# Altium schematic sheet TOP.SchDoc
size A2
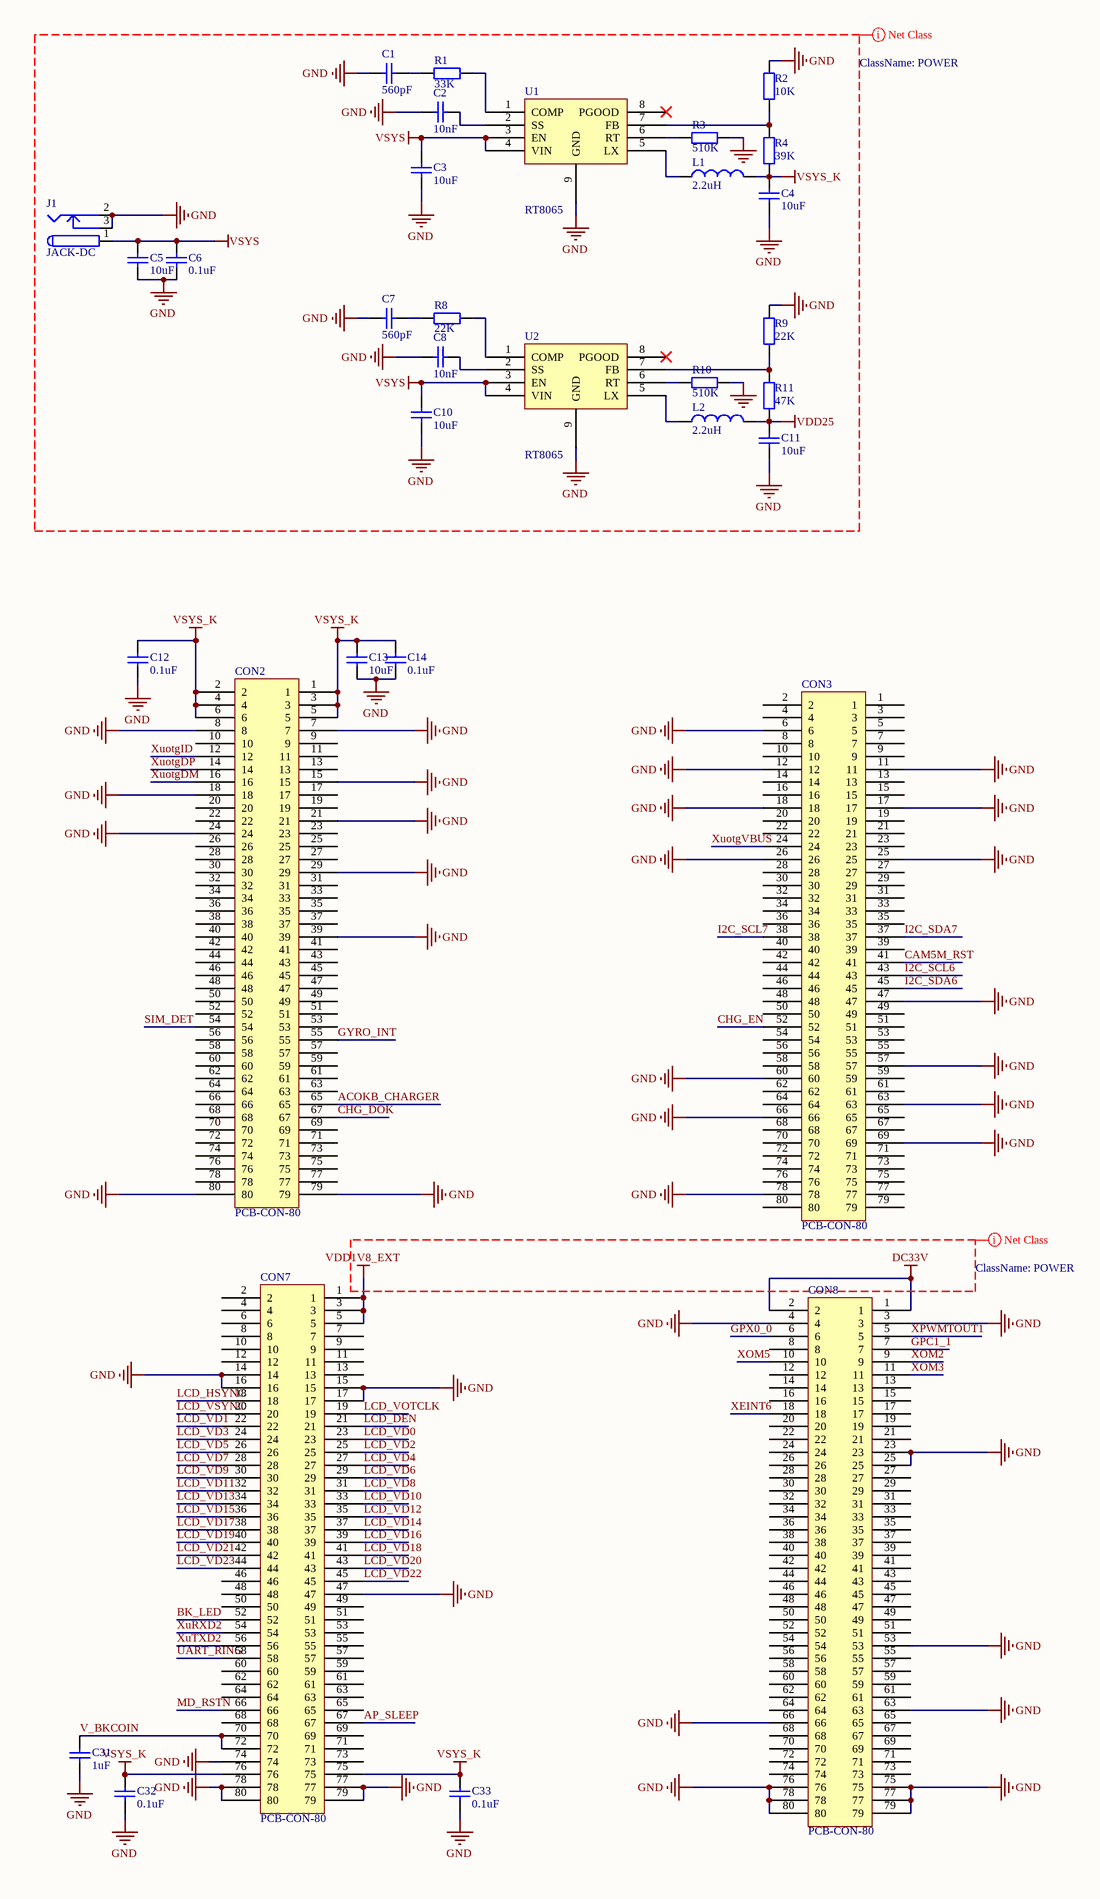
[diagram p0: TOP.SchDoc, left]
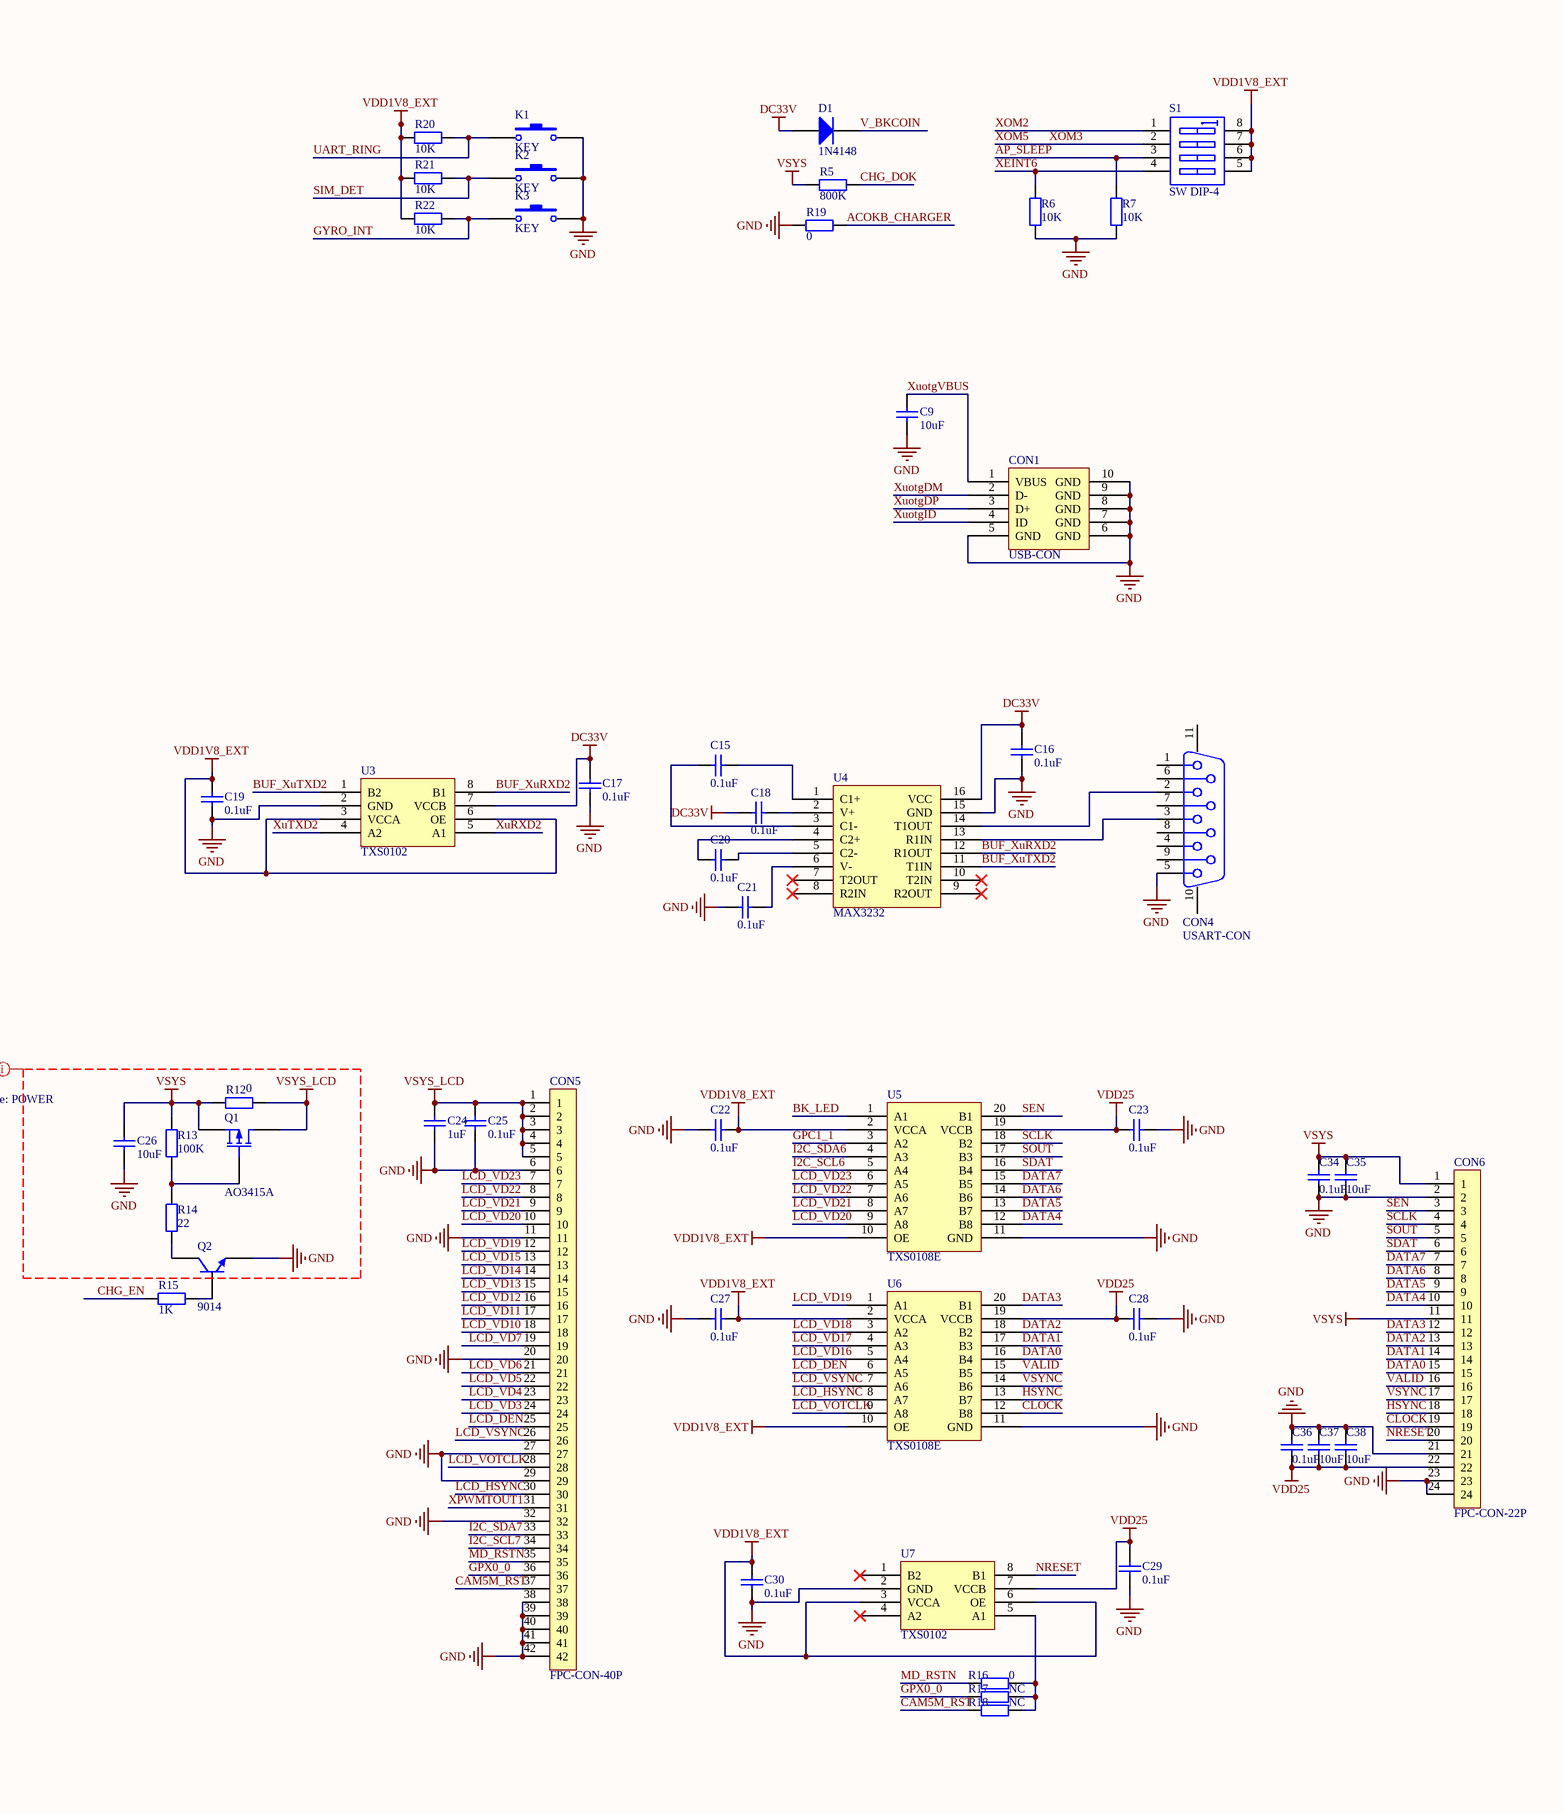
[diagram p1: TOP.SchDoc, right]

## Parts
C1  value 560pF  [0603]  (hidden comment: Cap)
C2  value 10nF  [0603]  (hidden comment: Cap)
C3  value 10uF  [0805]  (hidden comment: Cap)
C4  value 10uF  [0805]  (hidden comment: Cap)
C5  value 10uF  [0805]  (hidden comment: Cap)
C6  value 0.1uF  [0603]  (hidden comment: Cap)
C7  value 560pF  [0603]  (hidden comment: Cap)
C8  value 10nF  [0603]  (hidden comment: Cap)
C9  value 10uF  [0805]  (hidden comment: Cap)
C10  value 10uF  [0805]  (hidden comment: Cap)
C11  value 10uF  [0805]  (hidden comment: Cap)
C12  value 0.1uF  [0603]  (hidden comment: Cap)
C13  value 10uF  [0805]  (hidden comment: Cap)
C14  value 0.1uF  [0603]  (hidden comment: Cap)
C15  value 0.1uF  [0603]  (hidden comment: Cap)
C16  value 0.1uF  [0603]  (hidden comment: Cap)
C17  value 0.1uF  [0603]  (hidden comment: Cap)
C18  value 0.1uF  [0603]  (hidden comment: Cap)
C19  value 0.1uF  [0603]  (hidden comment: Cap)
C20  value 0.1uF  [0603]  (hidden comment: Cap)
C21  value 0.1uF  [0603]  (hidden comment: Cap)
C22  value 0.1uF  [0603]  (hidden comment: Cap)
C23  value 0.1uF  [0603]  (hidden comment: Cap)
C24  value 1uF  [0805]  (hidden comment: Cap)
C25  value 0.1uF  [0603]  (hidden comment: Cap)
C26  value 10uF  [0805]  (hidden comment: Cap)
C27  value 0.1uF  [0603]  (hidden comment: Cap)
C28  value 0.1uF  [0603]  (hidden comment: Cap)
C29  value 0.1uF  [0603]  (hidden comment: Cap)
C30  value 0.1uF  [0603]  (hidden comment: Cap)
C31  value 1uF  [0805]  (hidden comment: Cap)
C32  value 0.1uF  [0603]  (hidden comment: Cap)
C33  value 0.1uF  [0603]  (hidden comment: Cap)
C34  value 0.1uF  [0603]  (hidden comment: Cap)
C35  value 10uF  [0805]  (hidden comment: Cap)
C36  value 0.1uF  [0603]  (hidden comment: Cap)
C37  value 10uF  [0805]  (hidden comment: Cap)
C38  value 10uF  [0805]  (hidden comment: Cap)
CON1  USB-CON  [USB-CON]
CON2  PCB-CON-80  [PCB-CON-80]
CON3  PCB-CON-80  [PCB-CON-80]
CON4  USART-CON  [USART-CON]
CON5  FPC-CON-40P  [FPC-CON-40P]
CON6  FPC-CON-22P  [FPC-CON-22P]
CON7  PCB-CON-80  [PCB-CON-80]
CON8  PCB-CON-80  [PCB-CON-80]
D1  1N4148  [1206]
J1  JACK-DC  [JACK-DC]
K1  KEY  [KEY(3*6*2.5)]
K2  KEY  [KEY(3*6*2.5)]
K3  KEY  [KEY(3*6*2.5)]
L1  value 2.2uH  [1008]  (hidden comment: Inductor)
L2  value 2.2uH  [1008]  (hidden comment: Inductor)
Q1  AO3415A  [SOT-23]
Q2  9014  [SOT-23]
R1  value 33K  [0603]  (hidden comment: Res2)
R2  value 10K  [0603]  (hidden comment: Res2)
R3  value 510K  [0603]  (hidden comment: Res2)
R4  value 39K  [0603]  (hidden comment: Res2)
R5  value 800K  [0603]  (hidden comment: Res2)
R6  value 10K  [0603]  (hidden comment: Res2)
R7  value 10K  [0603]  (hidden comment: Res2)
R8  value 22K  [0603]  (hidden comment: Res2)
R9  value 22K  [0603]  (hidden comment: Res2)
R10  value 510K  [0603]  (hidden comment: Res2)
R11  value 47K  [0603]  (hidden comment: Res2)
R12  value 0  [0603]  (hidden comment: Res2)
R13  value 100K  [0603]  (hidden comment: Res2)
R14  value 22  [0603]  (hidden comment: Res2)
R15  value 1K  [0603]  (hidden comment: Res2)
R16  value 0  [0603]  (hidden comment: Res2)
R17  value NC  [0603]  (hidden comment: Res2)
R18  value NC  [0603]  (hidden comment: Res2)
R19  value 0  [0603]  (hidden comment: Res2)
R20  value 10K  [0603]  (hidden comment: Res2)
R21  value 10K  [0603]  (hidden comment: Res2)
R22  value 10K  [0603]  (hidden comment: Res2)
S1  SW DIP-4  [SW-4]
U1  RT8065  [RT8065(SOP8)]
U2  RT8065  [RT8065(SOP8)]
U3  TXS0102  [TXS0102(SOP8)]
U4  MAX3232  [MAX3232(SOP16)]
U5  TXS0108E  [TXS0108E(SOP20)]
U6  TXS0108E  [TXS0108E(SOP20)]
U7  TXS0102  [TXS0102(SOP8)]

## Nets
DC33V: C16.1 C17.2 C18.1 CON8.1 CON8.2 D1.1(A) U3.7(VCCB) U4.16(VCC)
GND: C1.2 C2.2 C3.1 C4.1 C5.1 C6.2 C7.2 C8.2 C9.1 C10.1 C11.1 C12.2 C13.1 C14.2 C16.2 C17.1 C19.1 C21.1 C22.1 C23.2 C24.2 C25.1 C26.1 C27.1 C28.2 C29.1 C30.1 C31.2 C32.2 C33.2 C34.1 C35.1 C36.2 C37.2 C38.2 CON1.5(GND) CON1.6(GND) CON1.7(GND) CON1.8(GND) CON1.9(GND) CON1.10(GND) CON2.7 CON2.8 CON2.15 CON2.18 CON2.21 CON2.24 CON2.29 CON2.39 CON2.79 CON2.80 CON3.6 CON3.11 CON3.12 CON3.17 CON3.18 CON3.25 CON3.26 CON3.47 CON3.57 CON3.60 CON3.63 CON3.66 CON3.69 CON3.78 CON4.5 CON5.6 CON5.11 CON5.20 CON5.27 CON5.29 CON5.32 CON5.38 CON5.39 CON5.40 CON5.41 CON5.42 CON6.2 CON6.21 CON6.23 CON6.24 CON7.14 CON7.15 CON7.16 CON7.17 CON7.47 CON7.74 CON7.77 CON7.78 CON7.79 CON7.80 CON8.3 CON8.4 CON8.23 CON8.25 CON8.53 CON8.63 CON8.66 CON8.75 CON8.76 CON8.77 CON8.78 CON8.79 CON8.80 J1.2 J1.3 K1.2 K2.2 K3.2 Q2.2(E) R2.2 R3.2 R6.2 R7.1 R9.2 R10.2 R19.1 U1.9(GND) U2.9(GND) U3.2(GND) U4.15(GND) U5.11(GND) U6.11(GND) U7.2(GND)
VDD1V8_EXT: C19.2 C22.2 C27.2 C30.2 CON7.1 CON7.3 CON7.5 R20.1 R21.1 R22.1 S1.5(B4) S1.6(B3) S1.7(B2) S1.8(B1) U3.3(VCCA) U3.6(OE) U5.2(VCCA) U5.10(OE) U6.2(VCCA) U6.10(OE) U7.3(VCCA) U7.6(OE)
VDD25: C11.2 C23.1 C28.1 C29.2 C36.1 C37.1 C38.1 CON6.22 L2.2 R11.1 U5.19(VCCB) U6.19(VCCB) U7.7(VCCB)
VSYS: C3.2 C5.2 C6.1 C10.2 C26.2 C34.2 C35.2 CON6.1 CON6.11 J1.1 Q1.2(S) R5.1 R12.1 R13.2 U1.3(EN) U1.4(VIN) U2.3(EN) U2.4(VIN)
VSYS_K: C4.2 C12.1 C13.2 C14.1 C32.1 C33.1 CON2.1 CON2.2 CON2.3 CON2.4 CON2.5 CON2.6 CON7.75 CON7.76 L1.2 R4.1
VSYS_LCD: C24.1 C25.2 CON5.1 CON5.2 CON5.3 CON5.4 CON5.5 Q1.3(D) R12.2
ACOKB_CHARGER: CON2.65 R19.2
AP_SLEEP: CON7.67 R7.2 S1.3(A3)
BK_LED: CON7.52 U5.1(A1)
BUF_XuRXD2: U3.8(B1) U4.12(R1OUT)
BUF_XuTXD2: U3.1(B2) U4.11(T1IN)
CAM5M_RST: CON3.41 CON5.37 R18.1
CHG_DOK: CON2.67 R5.2
CHG_EN: CON3.52 R15.1
CLOCK: CON6.19 U6.12(B8)
DATA0: CON6.15 U6.16(B4)
DATA1: CON6.14 U6.17(B3)
DATA2: CON6.13 U6.18(B2)
DATA3: CON6.12 U6.20(B1)
DATA4: CON6.10 U5.12(B8)
DATA5: CON6.9 U5.13(B7)
DATA6: CON6.8 U5.14(B6)
DATA7: CON6.7 U5.15(B5)
GPC1_1: CON8.7 U5.3(A2)
GPX0_0: CON5.36 CON8.6 R17.1
GYRO_INT: CON2.55 K3.1 R22.2
HSYNC: CON6.18 U6.13(B7)
I2C_SCL6: CON3.43 U5.5(A4)
I2C_SCL7: CON3.38 CON5.34
I2C_SDA6: CON3.45 U5.4(A3)
I2C_SDA7: CON3.37 CON5.33
LCD_DEN: CON5.25 CON7.21 U6.6(A5)
LCD_HSYNC: CON5.30 CON7.18 U6.8(A7)
LCD_VD0: CON7.23
LCD_VD1: CON7.22
LCD_VD2: CON7.25
LCD_VD3: CON5.24 CON7.24
LCD_VD4: CON5.23 CON7.27
LCD_VD5: CON5.22 CON7.26
LCD_VD6: CON5.21 CON7.29
LCD_VD7: CON5.19 CON7.28
LCD_VD8: CON7.31
LCD_VD9: CON7.30
LCD_VD10: CON5.18 CON7.33
LCD_VD11: CON5.17 CON7.32
LCD_VD12: CON5.16 CON7.35
LCD_VD13: CON5.15 CON7.34
LCD_VD14: CON5.14 CON7.37
LCD_VD15: CON5.13 CON7.36
LCD_VD16: CON7.39 U6.5(A4)
LCD_VD17: CON7.38 U6.4(A3)
LCD_VD18: CON7.41 U6.3(A2)
LCD_VD19: CON5.12 CON7.40 U6.1(A1)
LCD_VD20: CON5.10 CON7.43 U5.9(A8)
LCD_VD21: CON5.9 CON7.42 U5.8(A7)
LCD_VD22: CON5.8 CON7.45 U5.7(A6)
LCD_VD23: CON5.7 CON7.44 U5.6(A5)
LCD_VOTCLK: CON5.28 CON7.19 U6.9(A8)
LCD_VSYNC: CON5.26 CON7.20 U6.7(A6)
MD_RSTN: CON5.35 CON7.66 R16.1
NRESET: CON6.20 U7.8(B1)
SCLK: CON6.4 U5.18(B2)
SDAT: CON6.6 U5.16(B4)
SEN: CON6.3 U5.20(B1)
SIM_DET: CON2.54 K2.1 R21.2
SOUT: CON6.5 U5.17(B3)
UART_RING: CON7.58 K1.1 R20.2
V_BKCOIN: C31.1 CON7.70 CON7.72 D1.2(K)
VALID: CON6.16 U6.15(B5)
VSYNC: CON6.17 U6.14(B6)
XEINT6: CON8.18 R6.1 S1.4(A4)
XOM2: CON8.9 S1.1(A1)
XOM3: CON8.10 CON8.11 S1.2(A2)  [also labelled XOM5]
XPWMTOUT1: CON5.31 CON8.5
XuotgDM: CON1.2(D-) CON2.16
XuotgDP: CON1.3(D+) CON2.14
XuotgID: CON1.4(ID) CON2.12
XuotgVBUS: C9.2 CON1.1(VBUS) CON3.24
XuRXD2: CON7.54 U3.5(A1)
XuTXD2: CON7.56 U3.4(A2)
NetC1_1: C1.1 R1.1
NetC2_1: C2.1 U1.2(SS)
NetC7_1: C7.1 R8.1
NetC8_1: C8.1 U2.2(SS)
NetC15_1: C15.1 U4.3(C1-)
NetC15_2: C15.2 U4.1(C1+)
NetC18_2: C18.2 U4.2(V+)
NetC20_1: C20.1 U4.4(C2+)
NetC20_2: C20.2 U4.5(C2-)
NetC21_2: C21.2 U4.6(V-)
NetCON4_2: CON4.2 U4.14(T1OUT)
NetCON4_3: CON4.3 U4.13(R1IN)
NetL1_1: L1.1 U1.5(LX)
NetL2_1: L2.1 U2.5(LX)
NetQ1_1: Q1.1(G) R13.1 R14.2
NetQ2_1: Q2.1(B) R15.2
NetQ2_3: Q2.3(C) R14.1
NetR1_2: R1.2 U1.1(COMP)
NetR2_1: R2.1 R4.2 U1.7(FB)
NetR3_1: R3.1 U1.6(RT)
NetR8_2: R8.2 U2.1(COMP)
NetR9_1: R9.1 R11.2 U2.7(FB)
NetR10_1: R10.1 U2.6(RT)
NetR16_2: R16.2 R17.2 R18.2 U7.5(A1)

Not connected (* = marked no-connect by the designer): CON2 9 10 11 13 17 19 20 22 23 25 26 27 28 30 31 32 33 34 35 36 37 38 40 41 42 43 44 45 46 47 48 49 50 51 52 53 56 57 58 59 60 61 62 63 64 66 68 69 70 71 72 73 74 75 76 77 78; CON3 1 2 3 4 5 7 8 9 10 13 14 15 16 19 20 21 22 23 27 28 29 30 31 32 33 34 35 36 39 40 42 44 46 48 49 50 51 53 54 55 56 58 59 61 62 64 65 67 68 70 71 72 73 74 75 76 77 79 80; CON4 1 4 6 7 8 9 10(MH1) 11(MH2); CON7 2 4 6 7 8 9 10 11 12 13 46 48 49 50 51 53 55 57 59 60 61 62 63 64 65 68 69 71 73; CON8 8 12 13 14 15 16 17 19 20 21 22 24 26 27 28 29 30 31 32 33 34 35 36 37 38 39 40 41 42 43 44 45 46 47 48 49 50 51 52 54 55 56 57 58 59 60 61 62 64 65 67 68 69 70 71 72 73 74; U1 8(PGOOD)*; U2 8(PGOOD)*; U4 7(T2OUT)* 8(R2IN)* 9(R2OUT)* 10(T2IN)*; U7 1(B2)* 4(A2)*

## Layout directives
net class POWER: DC33V, GND, VDD1V8_EXT, VDD25, VSYS, VSYS_K, VSYS_LCD

## Library data of the parts
C1-C38 = Cap: Capacitor; Published: 8-Jun-2000; LatestRevisionDate: 17-Jul-2002; LatestRevisionNote: Re-released for DXP Platform.; PackageReference: RAD-0.3; Publisher: Altium Limited
D1 = Diode: Default Diode; Published: 8-Jun-2000; LatestRevisionDate: 17-Jul-2002; LatestRevisionNote: Re-released for DXP Platform.; PackageVersion: Sep-1996; PackageReference: SMC; Publisher: Altium Limited; Code_JEDEC: DO-214-AB
L1 L2 = Inductor: Code_IEC: 1005; Published: 8-Jun-2000; LatestRevisionDate: 29-May-2009; LatestRevisionNote: IPC-7351 Footprint Added.; PackageReference: 0402-A; Publisher: Altium Limited; PackageDescription: Chip Inductor; Code_JEITA: 0402
R1-R22 = Res2: Resistor; Published: 8-Jun-2000; LatestRevisionDate: 17-Jul-2002; LatestRevisionNote: Re-released for DXP Platform.; PackageReference: AXIAL-0.4; Publisher: Altium Limited
S1 = SW DIP-4: DIP Switch, 4 Position, SPST; Published: 24-Mar-1999; LatestRevisionDate: 29-May-2009; LatestRevisionNote: IPC-7351 Footprint Added.; PackageVersion: Dec-2002; PackageReference: SO8; Publisher: Altium Limited; PackageDescription: 8-Pin Small Outline Integrated Circuit 1.27 mm Pitch; Code_JEDEC: MS-012-AA; Code_IPC: SOIC127P600-8
K1-K3 = KEY: Published: 24-Mar-1999; LatestRevisionDate: 17-Jul-2002; LatestRevisionNote: Re-released for DXP Platform.; PackageReference: SPST-2; Publisher: Altium Limited